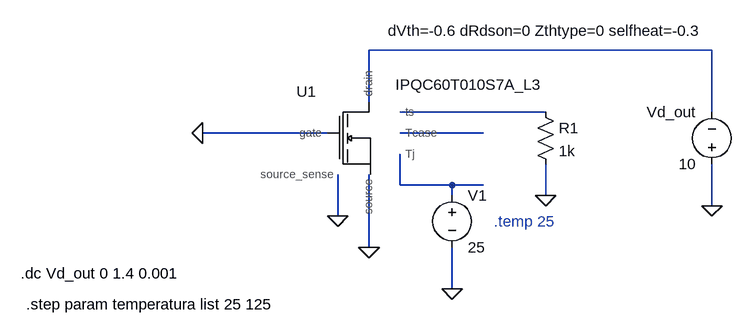
[diagram p0: schematic Si_MOSFET_diode.asc]
Si_MOSFET_diode.asc, the LTspice schematic file:
Version 4.1
SHEET 1 2716 680
WIRE 736 32 208 32
WIRE 208 112 208 32
WIRE 480 128 256 128
WIRE 736 128 736 32
WIRE 144 160 -48 160
WIRE 384 160 256 160
WIRE 256 240 256 192
WIRE 336 240 256 240
WIRE 384 240 336 240
WIRE 336 256 336 240
WIRE 480 256 480 208
WIRE 736 272 736 208
WIRE 160 288 160 224
WIRE 208 336 208 224
WIRE 336 400 336 336
FLAG 736 272 0
FLAG 208 336 0
FLAG 480 256 0
FLAG 336 400 0
FLAG 160 288 0
FLAG -48 160 0
SYMBOL IPQC60T010S7_L3 208 176 R0
WINDOW 39 273 -189 Top 2
SYMATTR SpiceLine dVth=-0.6 dRdson=0 Zthtype=0 selfheat=-0.3
SYMATTR InstName U1
SYMBOL voltage 736 224 R180
WINDOW 0 24 96 Left 2
WINDOW 3 24 16 Left 2
SYMATTR InstName Vd_out
SYMATTR Value 10
SYMBOL res 464 112 R0
SYMATTR InstName R1
SYMATTR Value 1k
SYMBOL voltage 336 240 R0
WINDOW 123 0 0 Left 0
WINDOW 39 0 0 Left 0
SYMATTR InstName V1
SYMATTR Value 25
TEXT -328 376 Left 2 !.dc Vd_out 0 1.4 0.001
TEXT 400 296 Left 2 ;.temp 25
TEXT -320 424 Left 2 !.step param temperatura list 25 125

The netlist it stands for:
* Si_MOSFET_diode.asc
X§U1 N001 0 0 0 N002 N004 N003 IPQC60T010S7A_L3 dVth=-0.6 dRdson=0 Zthtype=0 selfheat=-0.3  ; pins drain gate source source_sense ts Tj Tcase
Vd_out 0 N001 10
R1 N002 0 1k
V1 N004 0 25
.dc Vd_out 0 1.4 0.001
* .temp 25
.step param temperatura list 25 125
.lib IFX_S7A_TS_600V.lib
.backanno
.end